# EAGLE board BaseBoard5 (EAGLE 6.5.0), part 1 of 2
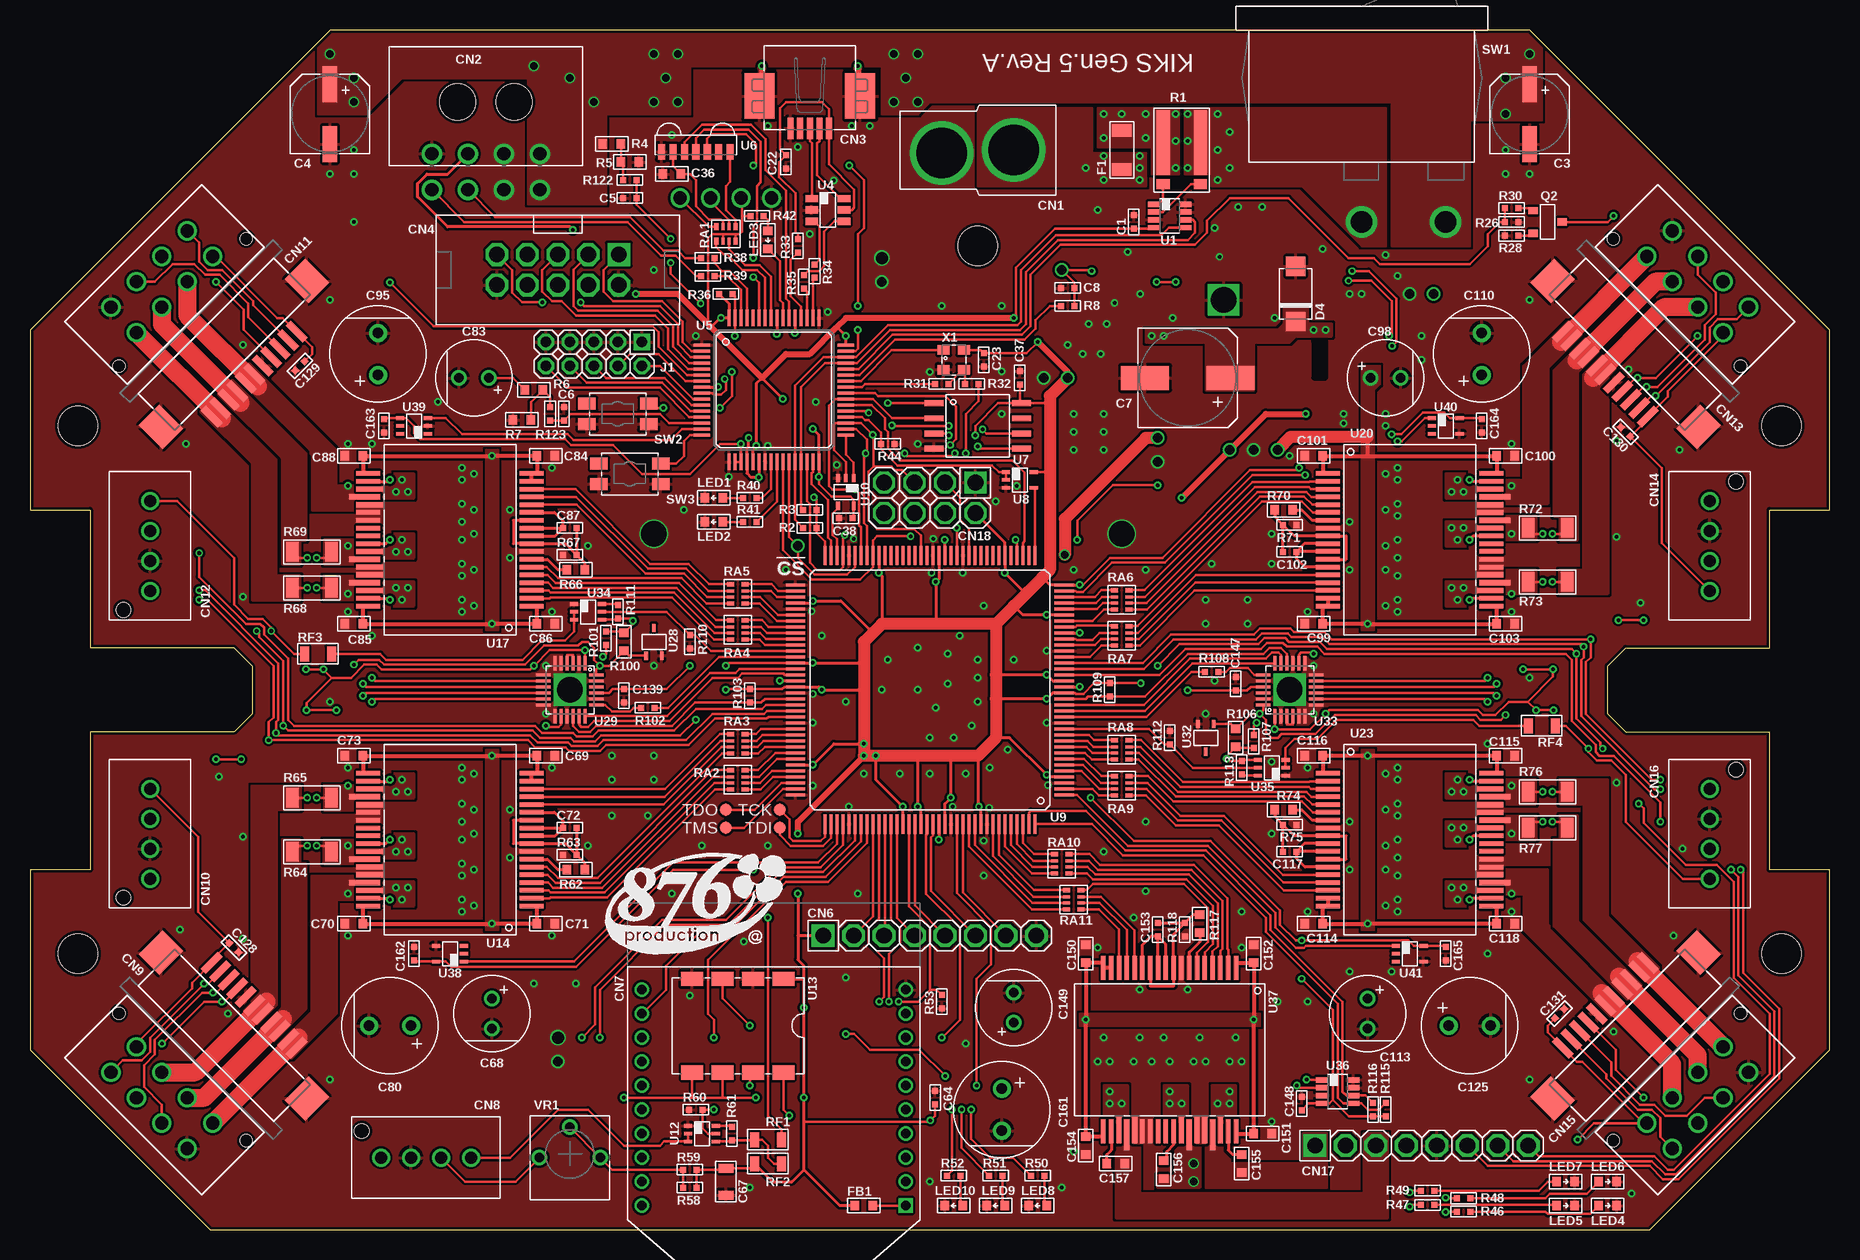
[diagram p5: board, top side]
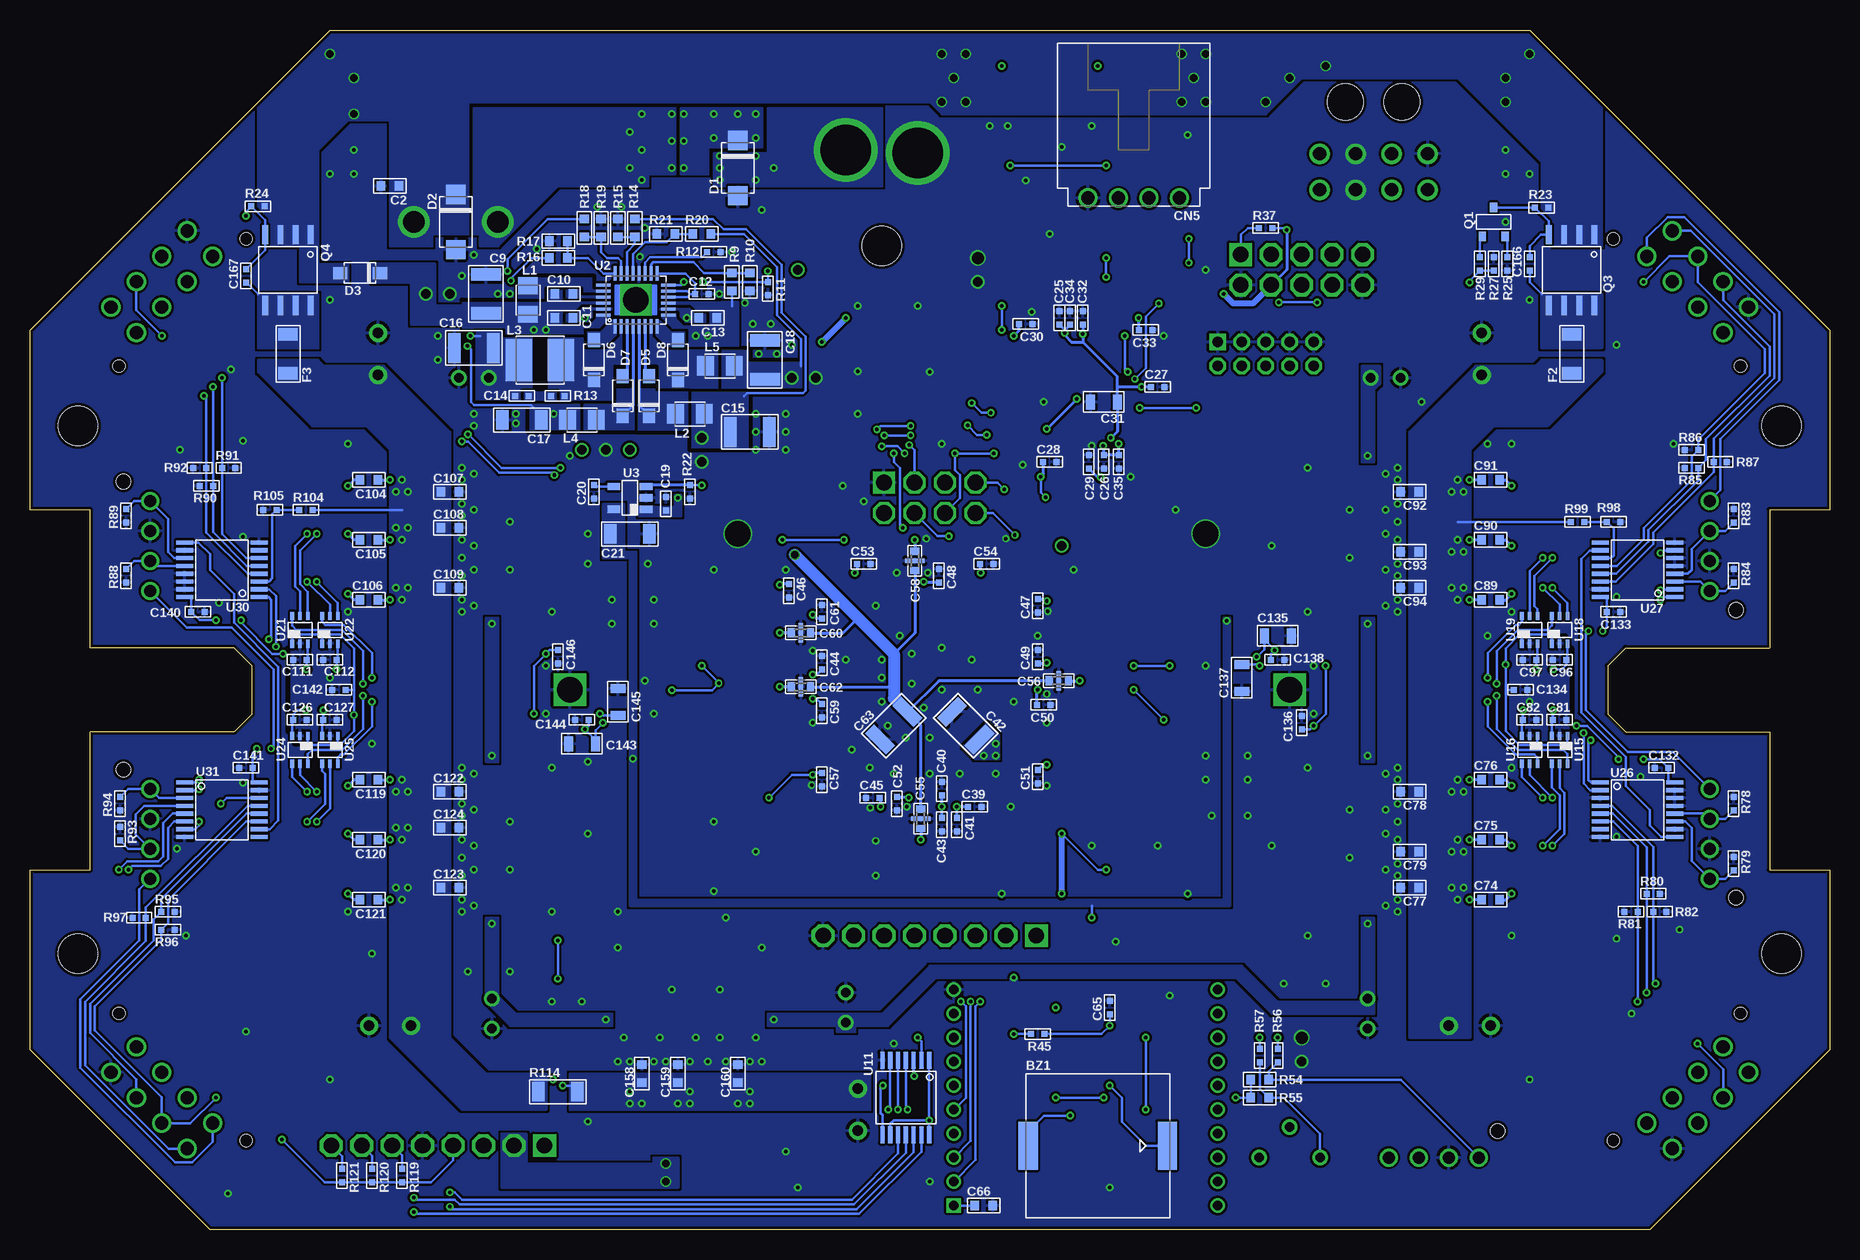
[diagram p6: board, bottom side, seen from below]

Size 150 x 100 mm. Coordinates in mm from the lower left corner, seen from the top.
Outline: 15,0 135,0 150,15 150,30 145,30 145,41.5 133,41.5 131.5,43 131.5,47 133,48.5 145,48.5 145,60 150,60 150,75 125,100 25,100 0,75 0,60 5,60 5,48.5 17,48.5 18.5,47 18.5,43 17,41.5 5,41.5 5,30 0,30 0,15 15,0
Copper layers (1*16): Top 0.035mm / dielectric 1.6mm / Bottom 0.035mm
Design rules "seeedstudio": minimum track width 6mil, minimum drill 0.3mm, track to track 6mil, track to pad 6mil, pad to pad 6mil, via to via 6mil, smd to smd 5mil, copper to edge 10mil, drill to drill 10mil, minimum pad ring 0.2mm, minimum via ring 6mil, stop-mask expansion 4mil, vias tented up to drill 3mm, thermal gap 10mil
Holes 3.3 mm at 4,67 4,23 146,23 146,67 79,82
tRestrict: 4 lines
bRestrict: 119 lines

## Footprints (pad centres in the part's own frame; a part is rotated, then mirrored left to right if it is on the bottom)
PKLCS1212 = smd 1.6 x 4: 1 -5.8,0; 2 5.8,0
1005 = smd 0.5 x 0.5: 1 -0.55,0; 2 0.55,0
1608 = smd 0.7 x 0.8: 1 -0.75,0; 2 0.75,0
ES-6.3 = smd 3 x 1.2: N 2.5,0; P -2.5,0
ES2-8 = smd 4 x 2: N 3.55,0; P -3.55,0
3225 = smd 1.05 x 2.5: 1 -1.625,0; 2 1.625,0
3216 = smd 1.05 x 1.6: 1 -1.625,0; 2 1.625,0
2012 = smd 0.75 x 1.25: 1 -1.125,0; 2 1.125,0
NFM18 = smd 0.6 x 0.8: 1 -0.8,0; 2 0.8,0 | smd 0.4 x 1.6: GND 0,0
E2.5-6.3 = drill 0.8 pad 1.3: N 1.25,0; P -1.25,0
E3.5-8 = drill 0.9 pad 1.5: N 1.75,0; P -1.75,0
T-CON = drill 4.2 pad 5.3: N -3,-0.25; P 3,0
43045-0800 = drill 1.1 pad 1.7: 1 -4.5,-4.32; 2 -1.5,-4.32; 3 1.5,-4.32; 4 4.5,-4.32; 5 -4.5,-7.32; 6 -1.5,-7.32; 7 1.5,-7.32; 8 4.5,-7.32 | hole 3: 2.35,0; -2.35,0
UX60SC-MB-5ST = smd 1.8 x 0.5: 1 2.7,1.6; 2 2.7,0.8; 3 2.7,0; 4 2.7,-0.8; 5 2.7,-1.6 | smd 3.8 x 2.5: S1 0,-4.2; S2 0,4.2
PIN2X5-BOX = drill 1.3 pad 1.9 square: 1 -5.08,-1.27 | drill 1.3 pad 1.9 octagon: 2 -5.08,1.27; 3 -2.54,-1.27; 4 -2.54,1.27; 5 0,-1.27; 6 0,1.27; 7 2.54,-1.27; 8 2.54,1.27; 9 5.08,-1.27; 10 5.08,1.27
70553-0003 = drill 1.1 pad 1.6: 1 3.81,0; 2 1.27,0; 3 -1.27,0; 4 -3.81,0
PIN1X8 = drill 1.3 pad 1.9 square: 1 -8.89,0 | drill 1.3 pad 1.9 octagon: 2 -6.35,0; 3 -3.81,0; 4 -1.27,0; 5 1.27,0; 6 3.81,0; 7 6.35,0; 8 8.89,0
XBEE-TH = drill 0.8 square: 1 -11,9 | drill 0.8: 2 -11,7; 3 -11,5; 4 -11,3; 5 -11,1; 6 -11,-1; 7 -11,-3; 8 -11,-5; 9 -11,-7; 10 -11,-9; 11 11,-9; 12 11,-7; 13 11,-5; 14 11,-3; 15 11,-1; 16 11,1; 17 11,3; 18 11,5; 19 11,7; 20 11,9
53375-04 = drill 1 pad 1.5: 1 3.75,0; 2 1.25,0; 3 -1.25,0; 4 -3.75,0 | hole 1.2: 5.35,-2.2
MOTOR_COMPLEX2 = smd 0.6 x 2: 1.1 5,-2.4; 1.2 4,-2.4; 1.3 3,-2.4; 1.4 2,-2.4; 1.5 1,-2.4; 1.6 0,-2.4; 1.7 -1,-2.4; 1.8 -2,-2.4; 1.9 -3,-2.4; 1.10 -4,-2.4; 1.11 -5,-2.4 | drill 1.1 pad 1.5: 2.1 -4.5,10; 2.2 -1.5,10; 2.3 1.5,10; 2.4 4.5,10; 2.5 -4.5,7; 2.6 -1.5,7; 2.7 1.5,7; 2.8 4.5,7 | smd 2.4 x 2.8: S1 -8.6,0; S2 8.6,0 | hole 1: -7.5,6.06; 7.5,6.06
PIN2X4 = drill 1.3 square: 1 -3.81,-1.27 | drill 1.3 octagon: 2 -3.81,1.27; 3 -1.27,-1.27; 4 -1.27,1.27; 5 1.27,-1.27; 6 1.27,1.27; 7 3.81,-1.27; 8 3.81,1.27
DO-214AC = smd 1.6 x 1.6: A 2.3,0; K -2.3,0
SOD123W = smd 1.2 x 1: A 1.65,0; K -1.65,0
PIN2X5-2.0 = drill 0.9 pad 1.3 square: 1 -4,-1 | drill 0.9 pad 1.3 octagon: 2 -4,1; 3 -2,-1; 4 -2,1; 5 0,-1; 6 0,1; 7 2,-1; 8 2,1; 9 4,-1; 10 4,1
L2520 = smd 1.4 x 1.65: 1 -1.2,0; 2 1.2,0
L4040 = smd 2.2 x 3.5: 1 -1.75,0; 2 1.75,0
1608' = smd 0.7 x 0.8: A 0.75,0; K -0.75,0
PAD = smd 1 x 1: 1 0,0
SOT23-3 = smd 0.6 x 0.8: 1 -0.95,-1.2; 2 0.95,-1.2; 3 0,1.2
SOP8 = smd 0.48 x 1.6: 1 -1.905,-2.95; 2 -0.635,-2.95; 3 0.635,-2.95; 4 1.905,-2.95; 5 1.905,2.95; 6 0.635,2.95; 7 -0.635,2.95; 8 -1.905,2.95
FC4L = smd 1.1 x 0.8: I1 -1.55,-2.85; I2 1.55,-2.85 | smd 1.1 x 5.4: V1 -1.55,0.6; V2 1.55,0.6
1005-A4 = smd 0.6 x 0.35: A1 -0.6,0.8; A2 0.6,0.8; D1 -0.6,-0.8; D2 0.6,-0.8 | smd 0.6 x 0.25: B1 -0.6,0.25; B2 0.6,0.25; C1 -0.6,-0.25; C2 0.6,-0.25
SLE6_10A4 = drill 1.8 pad 2.6: 1 0,7; P 0,0
EVQ-P2_P9 = smd 1.45 x 1: A1 -2.575,-0.85; A2 2.575,-0.85; B1 -2.575,0.85; B2 2.575,0.85
SOT23-8 = smd 0.45 x 1: 1 -0.975,-1.3; 2 -0.325,-1.3; 3 0.325,-1.3; 4 0.975,-1.3; 5 0.975,1.3; 6 0.325,1.3; 7 -0.325,1.3; 8 -0.975,1.3
QFN28-0.5-PAD = smd 1.2 x 0.25: 1 -2.2,1.75; 2 -2.2,1.25; 3 -2.2,0.75; 4 -2.2,0.25; 5 -2.2,-0.25; 6 -2.2,-0.75; 7 -2.2,-1.25; 8 -2.2,-1.75; 15 2.2,-1.75; 16 2.2,-1.25; 17 2.2,-0.75; 18 2.2,-0.25; 19 2.2,0.25; 20 2.2,0.75; 21 2.2,1.25; 22 2.2,1.75 | smd 0.25 x 1.2: 9 -1.25,-2.7; 10 -0.75,-2.7; 11 -0.25,-2.7; 12 0.25,-2.7; 13 0.75,-2.7; 14 1.25,-2.7; 23 1.25,2.7; 24 0.75,2.7; 25 0.25,2.7; 26 -0.25,2.7; 27 -0.75,2.7; 28 -1.25,2.7 | drill 2.1 pad 2.6 square: PAD 0,0
SOT23-5 = smd 0.6 x 1.05: 1 -0.95,-1.35; 2 0,-1.35; 3 0.95,-1.35; 4 0.95,1.35; 5 -0.95,1.35
SOT23-6 = smd 0.6 x 1.05: 1 -0.95,-1.35; 2 0,-1.35; 3 0.95,-1.35; 4 0.95,1.35; 5 0,1.35; 6 -0.95,1.35
QFP64-0.5 = smd 1.4 x 0.25: 1 -6,3.75; 2 -6,3.25; 3 -6,2.75; 4 -6,2.25; 5 -6,1.75; 6 -6,1.25; 7 -6,0.75; 8 -6,0.25; 9 -6,-0.25; 10 -6,-0.75; 11 -6,-1.25; 12 -6,-1.75; 13 -6,-2.25; 14 -6,-2.75; 15 -6,-3.25; 16 -6,-3.75; 33 6,-3.75; 34 6,-3.25; 35 6,-2.75; 36 6,-2.25; 37 6,-1.75; 38 6,-1.25; 39 6,-0.75; 40 6,-0.25; 41 6,0.25; 42 6,0.75; 43 6,1.25; 44 6,1.75; 45 6,2.25; 46 6,2.75; 47 6,3.25; 48 6,3.75 | smd 0.25 x 1.4: 17 -3.75,-6; 18 -3.25,-6; 19 -2.75,-6; 20 -2.25,-6; 21 -1.75,-6; 22 -1.25,-6; 23 -0.75,-6; 24 -0.25,-6; 25 0.25,-6; 26 0.75,-6; 27 1.25,-6; 28 1.75,-6; 29 2.25,-6; 30 2.75,-6; 31 3.25,-6; 32 3.75,-6; 49 3.75,6; 50 3.25,6; 51 2.75,6; 52 2.25,6; 53 1.75,6; 54 1.25,6; 55 0.75,6; 56 0.25,6; 57 -0.25,6; 58 -0.75,6; 59 -1.25,6; 60 -1.75,6; 61 -2.25,6; 62 -2.75,6; 63 -3.25,6; 64 -3.75,6
TFBS4650 = smd 0.6 x 1.3: 1 -2.85,0.65; 2 -1.9,0.65; 3 -0.95,0.65; 4 0,0.65; 5 0.95,0.65; 6 1.9,0.65; 7 2.85,0.65
SOP8W = smd 0.48 x 1.6: 1 -1.905,-3.65; 2 -0.635,-3.65; 3 0.635,-3.65; 4 1.905,-3.65; 5 1.905,3.65; 6 0.635,3.65; 7 -0.635,3.65; 8 -1.905,3.65
SC70-5 = smd 0.3 x 0.7: 1 -0.65,-1.15; 2 0,-1.15; 3 0.65,-1.15; 4 0.65,1.15; 5 -0.65,1.15
QFP144-0.5 = smd 1.6 x 0.25: 1 -11.2,8.75; 2 -11.2,8.25; 3 -11.2,7.75; 4 -11.2,7.25; 5 -11.2,6.75; 6 -11.2,6.25; 7 -11.2,5.75; 8 -11.2,5.25; 9 -11.2,4.75; 10 -11.2,4.25; 11 -11.2,3.75; 12 -11.2,3.25; 13 -11.2,2.75; 14 -11.2,2.25; 15 -11.2,1.75; 16 -11.2,1.25; 17 -11.2,0.75; 18 -11.2,0.25; 19 -11.2,-0.25; 20 -11.2,-0.75; 21 -11.2,-1.25; 22 -11.2,-1.75; 23 -11.2,-2.25; 24 -11.2,-2.75; 25 -11.2,-3.25; 26 -11.2,-3.75; 27 -11.2,-4.25; 28 -11.2,-4.75; 29 -11.2,-5.25; 30 -11.2,-5.75; 31 -11.2,-6.25; 32 -11.2,-6.75; 33 -11.2,-7.25; 34 -11.2,-7.75; 35 -11.2,-8.25; 36 -11.2,-8.75; 73 11.2,-8.75; 74 11.2,-8.25; 75 11.2,-7.75; 76 11.2,-7.25; 77 11.2,-6.75; 78 11.2,-6.25; 79 11.2,-5.75; 80 11.2,-5.25; 81 11.2,-4.75; 82 11.2,-4.25; 83 11.2,-3.75; 84 11.2,-3.25; 85 11.2,-2.75; 86 11.2,-2.25; 87 11.2,-1.75; 88 11.2,-1.25; 89 11.2,-0.75; 90 11.2,-0.25; 91 11.2,0.25; 92 11.2,0.75; 93 11.2,1.25; 94 11.2,1.75; 95 11.2,2.25; 96 11.2,2.75; 97 11.2,3.25; 98 11.2,3.75; 99 11.2,4.25; 100 11.2,4.75; 101 11.2,5.25; 102 11.2,5.75; 103 11.2,6.25; 104 11.2,6.75; 105 11.2,7.25; 106 11.2,7.75; 107 11.2,8.25; 108 11.2,8.75 | smd 0.25 x 1.6: 37 -8.75,-11.2; 38 -8.25,-11.2; 39 -7.75,-11.2; 40 -7.25,-11.2; 41 -6.75,-11.2; 42 -6.25,-11.2; 43 -5.75,-11.2; 44 -5.25,-11.2; 45 -4.75,-11.2; 46 -4.25,-11.2; 47 -3.75,-11.2; 48 -3.25,-11.2; 49 -2.75,-11.2; 50 -2.25,-11.2; 51 -1.75,-11.2; 52 -1.25,-11.2; 53 -0.75,-11.2; 54 -0.25,-11.2; 55 0.25,-11.2; 56 0.75,-11.2; 57 1.25,-11.2; 58 1.75,-11.2; 59 2.25,-11.2; 60 2.75,-11.2; 61 3.25,-11.2; 62 3.75,-11.2; 63 4.25,-11.2; 64 4.75,-11.2; 65 5.25,-11.2; 66 5.75,-11.2; 67 6.25,-11.2; 68 6.75,-11.2; 69 7.25,-11.2; 70 7.75,-11.2; 71 8.25,-11.2; 72 8.75,-11.2; 109 8.75,11.2; 110 8.25,11.2; 111 7.75,11.2; 112 7.25,11.2; 113 6.75,11.2; 114 6.25,11.2; 115 5.75,11.2; 116 5.25,11.2; 117 4.75,11.2; 118 4.25,11.2; 119 3.75,11.2; 120 3.25,11.2; 121 2.75,11.2; 122 2.25,11.2; 123 1.75,11.2; 124 1.25,11.2; 125 0.75,11.2; 126 0.25,11.2; 127 -0.25,11.2; 128 -0.75,11.2; 129 -1.25,11.2; 130 -1.75,11.2; 131 -2.25,11.2; 132 -2.75,11.2; 133 -3.25,11.2; 134 -3.75,11.2; 135 -4.25,11.2; 136 -4.75,11.2; 137 -5.25,11.2; 138 -5.75,11.2; 139 -6.25,11.2; 140 -6.75,11.2; 141 -7.25,11.2; 142 -7.75,11.2; 143 -8.25,11.2; 144 -8.75,11.2
TSSOP14 = smd 0.35 x 1.4: 1 -1.95,-3.1; 2 -1.3,-3.1; 3 -0.65,-3.1; 4 0,-3.1; 5 0.65,-3.1; 6 1.3,-3.1; 7 1.95,-3.1; 8 1.95,3.1; 9 1.3,3.1; 10 0.65,3.1; 11 0,3.1; 12 -0.65,3.1; 13 -1.3,3.1; 14 -1.95,3.1
SC70-6 = smd 0.3 x 0.7: 1 -0.65,-1.15; 2 0,-1.15; 3 0.65,-1.15; 4 0.65,1.15; 5 0,1.15; 6 -0.65,1.15
AE-NJU72501 = smd 1.2 x 1.8: 1 -3.9,3.81; 2 -3.9,1.27; 3 -3.9,-1.27; 4 -3.9,-3.81; 5 3.9,-3.81; 6 3.9,-1.27; 7 3.9,1.27; 8 3.9,3.81
HSSOP36 = smd 0.381 x 2: 1 -5.525,-6.8; 2 -4.875,-6.8; 3 -4.225,-6.8; 4 -3.575,-6.8; 5 -2.925,-6.8; 6 -2.275,-6.8; 7 -1.625,-6.8; 8 -0.975,-6.8; 9 -0.325,-6.8; 10 0.325,-6.8; 11 0.975,-6.8; 12 1.625,-6.8; 13 2.275,-6.8; 14 2.925,-6.8; 15 3.575,-6.8; 16 4.225,-6.8; 17 4.875,-6.8; 18 5.525,-6.8; 19 5.525,6.8; 20 4.875,6.8; 24 2.275,6.8; 25 1.625,6.8; 26 0.975,6.8; 27 0.325,6.8; 28 -0.325,6.8; 35 -4.875,6.8; 36 -5.525,6.8 | smd 0.44 x 2.3: 21 4.225,6.65; 23 2.925,6.65; 29 -0.975,6.65; 31 -2.275,6.65; 32 -2.925,6.65; 34 -4.225,6.65 | smd 0.44 x 2.6: 22 3.575,7.1; 30 -1.625,7.1; 33 -3.575,7.1
TSSOP16 = smd 0.35 x 1.4: 1 -2.275,-3.1; 2 -1.625,-3.1; 3 -0.975,-3.1; 4 -0.325,-3.1; 5 0.325,-3.1; 6 0.975,-3.1; 7 1.625,-3.1; 8 2.275,-3.1; 9 2.275,3.1; 10 1.625,3.1; 11 0.975,3.1; 12 0.325,3.1; 13 -0.325,3.1; 14 -0.975,3.1; 15 -1.625,3.1; 16 -2.275,3.1
SC70-3 = smd 0.3 x 0.7: 1 -0.65,-1.15; 2 0.65,-1.15; 3 0,1.15
QFN24-0.5 = smd 1.2 x 0.25: 1 -2.2,1.25; 2 -2.2,0.75; 3 -2.2,0.25; 4 -2.2,-0.25; 5 -2.2,-0.75; 6 -2.2,-1.25; 13 2.2,-1.25; 14 2.2,-0.75; 15 2.2,-0.25; 16 2.2,0.25; 17 2.2,0.75; 18 2.2,1.25 | smd 0.25 x 1.2: 7 -1.25,-2.2; 8 -0.75,-2.2; 9 -0.25,-2.2; 10 0.25,-2.2; 11 0.75,-2.2; 12 1.25,-2.2; 19 1.25,2.2; 20 0.75,2.2; 21 0.25,2.2; 22 -0.25,2.2; 23 -0.75,2.2; 24 -1.25,2.2 | drill 2.1 pad 2.7 square: P 0,0
VR = drill 0.8 pad 1.3: A -2.54,0; B 2.54,0; W 0,2.54
OSC2520 = smd 0.8 x 1: 1 -0.825,-0.85; 2 0.825,-0.85; 3 0.825,0.85; 4 -0.825,0.85

## Placement (x,y rotation side)
BZ1  PKLCS1212E4001  [PKLCS1212]  61,7 0 bottom
C1  100n  [1005]  92,84 90 top
C2  100n  [1608]  120,87 180 bottom
C3  100u  [ES-6.3]  125,93 270 top
C4  100u  [ES-6.3]  25,93 270 top
C5  10n  [1005]  50,86 180 top
C6  10n  [1005]  44.5,68 90 top
C7  330u  [ES2-8]  96.5,71 180 top
C8  1u  [1005]  86.5,78.5 180 top
C9  22u  [3225]  112,78 90 bottom
C10  1u  [1608]  105.5,78 180 bottom
C11  1u  [1608]  105.5,76 0 bottom
C12  10n  [1005]  94,78 0 bottom
C13  1u  [1608]  93.5,76 180 bottom
C14  1n  [1005]  109,69.5 180 bottom
C15  100u  [3225]  90,66.5 0 bottom
C16  22u  [3225]  113,73.5 180 bottom
C17  22u  [3216]  109,67.5 180 bottom
C18  100u  [3225]  88.75,72.5 90 bottom
C19  1u  [1005]  97,60.5 90 bottom
C20  10n  [1005]  103,61.5 270 bottom
C21  22u  [3216]  100,58 0 bottom
C22  100n  [1005]  63,89 270 top
C23  10n  [1005]  79.5,72.5 270 top
C25  1n  [1005]  64.2,76 90 bottom
C26  100n  [1005]  60.5,64 270 bottom
C27  100n  [1005]  56,70.25 0 bottom
C28  100n  [1005]  65,64 0 bottom
C29  100n  [1005]  61.75,64 90 bottom
C30  100n  [1005]  67,75.5 0 bottom
C31  22u  [2012]  60.5,69 180 bottom
C32  100n  [1005]  62.25,76 90 bottom
C33  100n  [1005]  57,75 0 bottom
C34  100n  [1005]  63.3,76 90 bottom
C35  100n  [1005]  59.25,64 270 bottom
C36  10u  [1608]  53.5,88 180 top
C37  100n  [1005]  82.5,71 90 top
C38  100n  [1005]  68,59.3 180 top
C39  1n  [1005]  71.25,35.25 0 bottom
C40  1n  [1005]  74,36.75 90 bottom
C41  100n  [1005]  72.75,33.75 270 bottom
C42  100u  [3225]  72,42 135 bottom
C43  100n  [1005]  74,33.75 270 bottom
C44  100n  [1005]  84,47.25 90 bottom
C45  100n  [1005]  79.75,36 180 bottom
C46  100n  [1005]  86.75,53.25 270 bottom
C47  100n  [1005]  66,52 270 bottom
C48  100n  [1005]  74.25,54.5 90 bottom
C49  100n  [1005]  66,47.75 90 bottom
C50  100n  [1005]  65.5,43.75 0 bottom
C51  100n  [1005]  66,37.75 270 bottom
C52  100n  [1005]  77.75,35.5 270 bottom
C53  100n  [1005]  80.5,55.5 0 bottom
C54  100n  [1005]  70.25,55.5 0 bottom
C55  100n  [NFM18]  75.75,34.25 90 bottom
C56  100n  [NFM18]  64.25,45.75 180 bottom
C57  100n  [1005]  84,37.5 270 bottom
C58  100n  [NFM18]  76.25,55.75 270 bottom
C59  100n  [1005]  84,43.25 270 bottom
C60  100n  [NFM18]  85.75,49.75 0 bottom
C61  100n  [1005]  84,51.5 90 bottom
C62  100n  [NFM18]  85.75,45.25 0 bottom
C63  100u  [3225]  78,42 225 bottom
C64  1u  [1005]  75.45,11 90 top
C65  1n  [1005]  60,18.5 90 bottom
C66  1u  [1608]  70.5,2 0 bottom
C67  22u  [2012]  58,4 270 top
C68  100u  [E2.5-6.3]  38.5,18 270 top
C69  1u  [1608]  43,39.5 0 top
C70  1u  [1608]  27,25.5 180 top
C71  1u  [1608]  43,25.5 0 top
C72  100n  [1005]  45,33.5 0 top
C73  1u  [1608]  27,39.5 180 top
C74  100n  [1608]  28.25,27.5 0 bottom
C75  100n  [1608]  28.25,32.5 0 bottom
C76  100n  [1608]  28.25,37.5 0 bottom
C77  100n  [1608]  35,28.5 180 bottom
C78  100n  [1608]  35,36.5 180 bottom
C79  100n  [1608]  35,31.5 180 bottom
C80  220u  [E3.5-8]  30,17 180 top
C81  100n  [1005]  22.5,42.5 0 bottom
C82  100n  [1005]  25,42.5 0 bottom
C83  100u  [E2.5-6.3]  37,71 180 top
C84  1u  [1608]  43,64.5 0 top
C85  1u  [1608]  27,50.5 180 top
C86  1u  [1608]  43,50.5 0 top
C87  100n  [1005]  45,58.5 0 top
C88  1u  [1608]  27,64.5 180 top
C89  100n  [1608]  28.25,52.5 0 bottom
C90  100n  [1608]  28.25,57.5 0 bottom
C91  100n  [1608]  28.25,62.5 0 bottom
C92  100n  [1608]  35,61.5 180 bottom
C93  100n  [1608]  35,56.5 180 bottom
C94  100n  [1608]  35,53.5 180 bottom
C95  220u  [E3.5-8]  29,73 90 top
C96  100n  [1005]  22.5,47.5 180 bottom
C97  100n  [1005]  25,47.5 180 bottom
C98  100u  [E2.5-6.3]  113,71 0 top
C99  1u  [1608]  107,50.5 180 top
C100  1u  [1608]  123,64.5 0 top
C101  1u  [1608]  107,64.5 180 top
C102  100n  [1005]  105,56.5 180 top
C103  1u  [1608]  123,50.5 0 top
C104  100n  [1608]  121.75,62.5 180 bottom
C105  100n  [1608]  121.75,57.5 180 bottom
C106  100n  [1608]  121.75,52.5 180 bottom
C107  100n  [1608]  115,61.5 0 bottom
C108  100n  [1608]  115,58.5 0 bottom
C109  100n  [1608]  115,53.5 0 bottom
C110  220u  [E3.5-8]  121,73 90 top
C111  100n  [1005]  127.5,47.5 180 bottom
C112  100n  [1005]  125,47.5 180 bottom
C113  100u  [E2.5-6.3]  111.5,18 270 top
C114  1u  [1608]  107,25.5 180 top
C115  1u  [1608]  123,39.5 0 top
C116  1u  [1608]  107,39.5 180 top
C117  100n  [1005]  105,31.5 180 top
C118  1u  [1608]  123,25.5 0 top
C119  100n  [1608]  121.75,37.5 180 bottom
C120  100n  [1608]  121.75,32.5 180 bottom
C121  100n  [1608]  121.75,27.5 180 bottom
C122  100n  [1608]  115,36.5 0 bottom
C123  100n  [1608]  115,28.5 0 bottom
C124  100n  [1608]  115,33.5 0 bottom
C125  220u  [E3.5-8]  120,17 0 top
C126  100n  [1005]  127.5,42.5 0 bottom
C127  100n  [1005]  125,42.5 0 bottom
C128  1u  [1005]  17,23.5 315 top
C129  1u  [1005]  22.5,72 225 top
C130  1u  [1005]  133,66.5 135 top
C131  1u  [1005]  127.5,18 45 top
C132  100n  [1005]  14,38.5 180 bottom
C133  100n  [1005]  18,51.5 0 bottom
C134  1u  [1005]  25.75,45 0 bottom
C135  22u  [2012]  46,49.5 0 bottom
C136  100n  [1005]  44,42.25 90 bottom
C137  22u  [2012]  49,46 270 bottom
C138  100n  [1005]  46,47.5 0 bottom
C139  100n  [1005]  49.5,44.5 270 top
C140  100n  [1005]  136,51.5 0 bottom
C141  100n  [1005]  132,38.5 180 bottom
C142  1u  [1005]  124.25,45 180 bottom
C143  22u  [2012]  104,40.5 180 bottom
C144  100n  [1005]  104,42.5 180 bottom
C145  22u  [2012]  101,44 90 bottom
C146  100n  [1005]  106,47.75 270 bottom
C147  100n  [1005]  100.5,45.5 90 top
C148  100n  [1005]  106,10.5 90 top
C149  100u  [E2.5-6.3]  82,18.5 90 top
C150  1u  [1608]  88,23 90 top
C151  1u  [1608]  102.75,8 0 top
C152  1u  [1608]  102,23 90 top
C153  100n  [1005]  94,25 90 top
C154  1u  [1608]  88,7 270 top
C155  100n  [1608]  101,5.5 270 top
C156  100n  [1608]  94.5,5 270 top
C157  100n  [1608]  90.5,5.5 0 top
C158  100n  [1608]  99,13 90 bottom
C159  100n  [1608]  96,13 90 bottom
C160  100n  [1608]  91,13 90 bottom
C161  220u  [E3.5-8]  81,10 270 top
C162  100n  [1005]  32,23 90 top
C163  100n  [1005]  29.5,67 270 top
C164  100n  [1005]  121,67 270 top
C165  100n  [1005]  118,23 270 top
C166  10n  [1005]  25,80.5 90 bottom
C167  10n  [1005]  132,79.5 90 bottom
CN1  Battery  [T-CON]  79,90 0 top
CN2  Kicker  [43045-0800]  38,94 0 top
CN3  UX60SC-MB-5ST  [UX60SC-MB-5ST]  65,94.5 270 top
CN4  CN-JTAG_ALTERA-BOX  [PIN2X5-BOX]  44,80.01 180 top
CN5  Debug  [70553-0003]  58,86 0 bottom
CN6  External SPI 1  [PIN1X8]  75,24.5 0 top
CN7  XBee  [XBEE-TH]  62,11 180 top
CN8  Ball Sensor  [53375-04]  33,6 180 top
CN9  EC45FLAT2  [MOTOR_COMPLEX2]  17,17 135 top
CN10  Motor1  [53375-04]  10,33 270 top
CN11  EC45FLAT2  [MOTOR_COMPLEX2]  17,73 45 top
CN12  Motor2  [53375-04]  10,57 270 top
CN13  EC45FLAT2  [MOTOR_COMPLEX2]  133,73 315 top
CN14  Motor3  [53375-04]  140,57 90 top
CN15  EC45FLAT2  [MOTOR_COMPLEX2]  133,17 225 top
CN16  Motor4  [53375-04]  140,33 90 top
CN17  Dribble  [PIN1X8]  116,7 0 top
CN18  External SPI 2  [PIN2X4]  75,61 180 top
D1  SMAJ22A  [DO-214AC]  91,88.5 270 bottom
D2  SMAJ22A  [DO-214AC]  114.5,84 270 bottom
D3  PMEG4030ER  [SOD123W]  122.5,79.75 180 bottom
D4  SMAJ24A  [DO-214AC]  105.5,78 90 top
D5  PMEG4030ER  [SOD123W]  98.4,69.5 90 bottom
D6  PMEG4030ER  [SOD123W]  103,72.5 90 bottom
D7  PMEG4030ER  [SOD123W]  100.6,69.5 90 bottom
D8  PMEG4030ER  [SOD123W]  96,72.5 90 bottom
F1  15  [3216]  91,90 90 top
F2  10  [3216]  21.5,73 270 bottom
F3  10  [3216]  128.5,73 270 bottom
FB1  [1608]  69.5,2 0 top
J1  Setting  [PIN2X5-2.0]  47,73 180 top
L1  4.7u  [L2520]  108.5,77.5 90 bottom
L2  3.3u  [L2520]  95,68 0 bottom
L3  10u  [L4040]  107.5,72.5 180 bottom
L4  4.7u  [L2520]  104,67.5 180 bottom
L5  4.7u  [L2520]  92.5,72 0 bottom
LED1  [1608']  57,61 0 top
LED2  [1608']  57,59 0 top
LED3  [1608']  61.5,82.5 90 top
LED4  [1608']  131.5,2 180 top
LED5  [1608']  128,2 180 top
LED6  [1608']  131.5,4 180 top
LED7  [1608']  128,4 180 top
LED8  [1608']  84,2 0 top
LED9  [1608']  80.5,2 0 top
LED10  [1608']  77,2 0 top
LOGO1  LOGO-876_SMALL  [LOGO-876_SMALL]  48,23 0 top
P1  TCK  [PAD]  62.5,35 180 top
P2  TDI  [PAD]  62.5,33.5 180 top
P3  TDO  [PAD]  58,35 180 top
P4  TMS  [PAD]  58,33.5 180 top
Q1  [SOT23-3]  28,84 0 bottom
Q2  [SOT23-3]  126.5,84 270 top
Q3  Si4483ADY  [SOP8]  21.5,80 180 bottom
Q4  Si4483ADY  [SOP8]  128.5,80 180 bottom
R1  2m  [FC4L]  96,90 0 top
R2  10k  [1005]  65,58.5 0 top
R3  10k  [1005]  65,60 0 top
R4  100k  [1608]  48.5,90.5 180 top
R5  10k  [1608]  50,89 180 top
R6  100k  [1608]  42,70 180 top
R7  10k  [1608]  41,67.5 0 top
R8  10k  [1005]  86.5,77 0 top
R9  100k  [1608]  91.5,79 270 bottom
R10  24k  [1608]  90,79 90 bottom
R11  10k  [1005]  88.5,78.45 90 bottom
R12  10k  [1005]  93,81.5 180 bottom
R13  1k  [1005]  106,69.5 0 bottom
R14  3.9k  [1608]  99.6,83.5 90 bottom
R15  7.5k  [1608]  101,83.5 270 bottom
R16  24k  [1608]  105.95,81 180 bottom
R17  1.65k  [1608]  105.95,82.4 0 bottom
R18  24k  [1608]  103.8,83.5 90 bottom
R19  3.9k  [1608]  102.4,83.5 270 bottom
R20  24k  [1608]  94,83 0 bottom
R21  7.5k  [1608]  97,83 0 bottom
R22  10k  [1005]  95,61.5 90 bottom
R23  33k  [1005]  24,85.2 0 bottom
R24  33k  [1005]  131,85.3 0 bottom
R25  1k  [1005]  26.85,80.5 90 bottom
R26  1k  [1005]  123.5,82.85 0 top
R27  10k  [1005]  28,80.5 270 bottom
R28  10k  [1005]  123.5,84 180 top
R29  51  [1005]  29.15,80.5 270 bottom
R30  51  [1005]  123.5,85.15 180 top
R31  51  [1005]  76,70.5 180 top
R32  51  [1005]  78.5,70.5 0 top
R33  51  [1005]  64,82 90 top
R34  22  [1005]  65.4,79.9 270 top
R35  22  [1005]  64.5,79 270 top
R36  10k  [1005]  58,78 180 top
R37  10k  [1005]  47,83.5 0 bottom
R38  51  [1005]  56.5,81 180 top
R39  51  [1005]  56.5,79.5 180 top
R40  1k  [1005]  60,61 0 top
R41  1k  [1005]  60,59 0 top
R42  1k  [1005]  60.6,84.5 180 top
R44  10k  [1005]  71.5,65.5 180 top
R45  10k  [1005]  66,16.3 180 bottom
R46  1k  [1005]  119.5,1.5 180 top
R47  1k  [1005]  116.5,2.05 180 top
R48  1k  [1005]  119.5,2.6 180 top
R49  1k  [1005]  116.5,3.25 180 top
R50  1k  [1005]  84,4.5 180 top
R51  1k  [1005]  80.5,4.5 180 top
R52  1k  [1005]  77,4.5 180 top
R53  10k  [1005]  76,19 90 top
R54  3.9k  [1608]  47.5,12.5 180 bottom
R55  3.9k  [1608]  47.5,11 180 bottom
R56  1k  [1005]  46,14.5 90 bottom
R57  51  [1005]  47.5,14.5 90 bottom
R58  51  [1005]  55,3.5 0 top
R59  51  [1005]  55,5 0 top
R60  10k  [1005]  55.5,10 0 top
R61  10k  [1005]  58.5,8 270 top
R62  33k  [1608]  45.5,30 180 top
R63  1  [1005]  45,31.25 0 top
R64  5m  [3216]  23.5,31.5 180 top
R65  5m  [3216]  23.5,36 180 top
R66  33k  [1608]  45.5,55 180 top
R67  1  [1005]  45,56.25 0 top
R68  5m  [3216]  23.5,53.5 180 top
R69  5m  [3216]  23.5,56.5 180 top
R70  33k  [1608]  104.5,60 0 top
R71  1  [1005]  105,58.75 180 top
R72  5m  [3216]  126.5,58.5 0 top
R73  5m  [3216]  126.5,54 0 top
R74  33k  [1608]  104.5,35 0 top
R75  1  [1005]  105,33.75 180 top
R76  5m  [3216]  126.5,36.5 0 top
R77  5m  [3216]  126.5,33.5 0 top
R78  100k  [1005]  8,35.5 270 bottom
R79  100k  [1005]  8,30.5 270 bottom
R80  100k  [1005]  14.7,28 180 bottom
R81  100k  [1005]  16.55,26.5 0 bottom
R82  100k  [1005]  14.15,26.5 180 bottom
R83  100k  [1005]  8,59.5 270 bottom
R84  100k  [1005]  8,54.5 270 bottom
R85  100k  [1005]  11.5,63.5 0 bottom
R86  100k  [1005]  11.5,65 0 bottom
R87  100k  [1005]  9.1,64 180 bottom
R88  100k  [1005]  142,54.5 90 bottom
R89  100k  [1005]  142,59.5 90 bottom
R90  100k  [1005]  135.3,62 0 bottom
R91  100k  [1005]  133.45,63.5 180 bottom
R92  100k  [1005]  135.85,63.5 0 bottom
R93  100k  [1005]  142.5,33 270 bottom
R94  100k  [1005]  142.5,35.5 90 bottom
R95  100k  [1005]  138.5,26.5 180 bottom
R96  100k  [1005]  138.5,25 180 bottom
R97  100k  [1005]  140.9,26 0 bottom
R98  33k  [1005]  18,59 180 bottom
R99  100k  [1005]  21,59 180 bottom
R100  3.9k  [1608]  49.5,49 90 top
R101  51  [1005]  48,49.3 270 top
R102  51  [1005]  51.5,43.5 0 top
R103  10k  [1005]  60,44.5 90 top
R104  100k  [1005]  127,60 180 bottom
R105  33k  [1005]  130,60 0 bottom
R106  3.9k  [1608]  100.5,41 270 top
R107  51  [1005]  102,40.7 90 top
R108  51  [1005]  98.5,46.5 180 top
R109  10k  [1005]  90,45 90 top
R110  10k  [1005]  55,49 90 top
R111  10k  [1005]  49,51.5 270 top
R112  10k  [1005]  95,41 270 top
R113  10k  [1005]  101,38.5 90 top
R114  5m  [3216]  106,11.5 0 bottom
R115  10k  [1005]  113,10 270 top
R116  10k  [1005]  111.95,10 270 top
R117  33k  [1608]  97.5,25.5 270 top
R118  1  [1005]  96.25,25 90 top
R119  10k  [1005]  119,4.5 270 bottom
R120  10k  [1005]  121.5,4.5 270 bottom
R121  10k  [1005]  124,4.5 270 bottom
R122  1k  [1005]  50,87.5 0 top
R123  1k  [1005]  43.35,68 270 top
RA1  51  [1005-A4]  58,83 90 top
RA2  51  [1005-A4]  59,37.5 180 top
RA3  51  [1005-A4]  59,40.5 180 top
RA4  51  [1005-A4]  59,50 180 top
RA5  51  [1005-A4]  59,53 180 top
RA6  51  [1005-A4]  91,52.5 0 top
RA7  51  [1005-A4]  91,49.5 0 top
RA8  51  [1005-A4]  91,40 0 top
RA9  51  [1005-A4]  91,37 0 top
RA10  51  [1005-A4]  86,30.5 0 top
RA11  51  [1005-A4]  87,27.5 0 top
RF1  200m  [2012]  61.5,7.5 0 top
RF2  200m  [2012]  61.5,5.5 180 top
RF3  200m  [2012]  24,48 0 top
RF4  200m  [2012]  126,42 180 top
SW1  Power  [SLE6_10A4]  111,84 270 top
SW2  [EVQ-P2_P9]  49,68 0 top
SW3  [EVQ-P2_P9]  50,63 0 top
U1  INA219DCN  [SOT23-8]  95,84.5 270 top
U2  LT3504  [QFN28-0.5-PAD]  99.5,77.5 90 bottom
U3  SPX3819-50  [SOT23-5]  100,61 90 bottom
U4  IP4234CZ6  [SOT23-6]  66.5,85 270 top
U5  AT32UC3B0512-AU  [QFP64-0.5]  62,70 0 top
U6  TFBS4650  [TFBS4650]  55.5,90.5 180 top
U7  MX25L6445EM  [SOP8W]  79,67 270 top
U8  1G08DCK  [SC70-5]  82.5,62.5 270 top
U9  XC6SLX9-TQ144  [QFP144-0.5]  75,45 180 top
U10  1G08DCK  [SC70-5]  68,61.5 180 top
U11  TC74VHC164FT  [TSSOP14]  77,11 180 bottom
U12  FDG6323L  [SC70-6]  56,8 270 top
U13  AE-NJU72501  [AE-NJU72501]  59,17 270 top
U14  DRV8332  [HSSOP36]  35,32.5 90 top
U15  INA214  [SC70-6]  22.5,40 180 bottom
U16  INA214  [SC70-6]  25,40 180 bottom
U17  DRV8332  [HSSOP36]  35,57.5 90 top
U18  INA214  [SC70-6]  22.5,50 0 bottom
U19  INA214  [SC70-6]  25,50 0 bottom
U20  DRV8332  [HSSOP36]  115,57.5 270 top
U21  INA214  [SC70-6]  127.5,50 0 bottom
U22  INA214  [SC70-6]  125,50 0 bottom
U23  DRV8332  [HSSOP36]  115,32.5 270 top
U24  INA214  [SC70-6]  127.5,40 180 bottom
U25  INA214  [SC70-6]  125,40 180 bottom
U26  TC74VHC165FT  [TSSOP16]  16,35 270 bottom
U27  TC74VHC165FT  [TSSOP16]  16,55 90 bottom
U28  ADR5041  [SC70-3]  52,49 0 top
U29  ADS7950RGE  [QFN24-0.5]  45,45 270 top
U30  TC74VHC165FT  [TSSOP16]  134,55 90 bottom
U31  TC74VHC165FT  [TSSOP16]  134,35 270 bottom
U32  ADR5041  [SC70-3]  98,41 180 top
U33  ADS7950RGE  [QFN24-0.5]  105,45 90 top
U34  FDG6323L  [SC70-6]  46.5,51.5 270 top
U35  FDG6323L  [SC70-6]  103.5,38.5 90 top
U36  INA219DCN  [SOT23-8]  109,11.5 270 top
U37  DRV8332  [HSSOP36]  95,15 180 top
U38  TMP05  [SC70-5]  35,23 90 top
U39  MCP9701/LT  [SC70-6]  32,67 90 top
U40  TMP05  [SC70-5]  118,67 270 top
U41  TMP05  [SC70-5]  115,23 270 top
VR1  500  [VR]  45,6 0 top
X1  24MHz  [OSC2520]  77,72.5 270 top

## Tracks (layer width: path | path; a pad name or v marks a point on that pad's centre or on a via)
!ADC1_CS
  Top 0.2: U29.16 45.25,42 45.75,41.5 46.7,41.5 47.2,42 53.5,42 55.45,43.95 R103.1 60.95,43.95 61.25,44.25 U9.92
!ADC2_CS
  Top 0.2: U33.16 104.75,48 104.25,48.5 103.3,48.5 102.8,48 96.5,48 92.95,44.45 R109.1 88.2,44.45 88,44.25 U9.17
!FLASH_CS  (via drill 0.3)
  Top 0.2: U5.37 69.75,68.25 v69.9,68.1 | U7.1 v71.5,68.91 v71.5,68.9
  Bottom 0.2: v69.9,68.1 70.7,68.1 v71.5,68.9
!FPGA_CS  (via drill 0.8)
  Top 0.2: U9.67 68.75,55.25 68.1,54.6 65.4,54.6 64,56 v64,57 63.25,57.75 U5.27
!FPGA_INIT
  Top 0.2: U5.38 70.15,68.75 71.25,67.65 71.25,66.75 71.5,66.5 71.5,65.1 72.5,64.1 81.9,64.1 82.9,63.1 82.9,57.4 82.75,57.25 U9.39
!FPGA_PROG
  Top 0.2: U8.2 U8.1 80.75,63.15 80.2,63.7 72.3,63.7 70.95,65.05 R44.2 70.95,66.45 69.9,67.5 69.6,67.5 69.35,67.75 U5.36
!LED3
  Top 0.2: U5.55 62.75,77.25 62.5,77.5 62.5,80.75 LED3.K
!MCU_RESET  (via drill 0.3)
  Top 0.2: SW2.B2 51.92,68.5 v52.8,68.5 | v57.5,68.5 58.5,69.5 v58.5,71.5 | R36.1 58.75,77.8 U5.63 v58.75,74.5
  Bottom 0.2: v52.8,68.5 v57.5,68.5 | v58.75,74.5 58.75,71.75 v58.5,71.5
!MOT1_2_DO  (via drill 0.3)
  Top 0.2: v14.1,56.4 14.1,54.4 18,50.5 19.2,50.5 19.5,50.2 19.5,49.6 21.5,47.6 21.5,42.5 22,42 42.1,42 42.7,41.4 45.25,41.4 45.55,41.1 46.9,41.1 47.4,41.6 53.7,41.6 55.5,43.4 61,43.4 61.35,43.75 U9.93
  Bottom 0.2: U27.7 13.88,56.62 v14.1,56.4
!MOT1_2_LATCH  (via drill 0.3)
  Top 0.2: v14.1,52.5 14.8,52.5 20.3,47 20.3,42.7 19.9,42.3 v19.9,40.8 41.5,40.8 42.1,40.2 44.65,40.2 44.95,39.9 47.5,39.9 48,40.4 54.9,40.4 57.1,42.6 61.4,42.6 61.55,42.75 U9.95
  Bottom 0.2: v19.9,40.8 20.1,40.6 20.1,37.5 19.88,37.27 U26.1 | U27.1 13.88,52.73 v14.1,52.5
!MOT1_FAULT
  Top 0.2: RA2.B1 60.85,37.25 61.85,38.25 U9.104
!MOT1_HU_5  (via drill 0.3)
  Top 0.2: CN9.2.2 10.99,10.41 9.5,11.9 9.5,13.7 10.4,14.6 10.4,15.8 14.35,19.75 v15.25,19.75 15.51,19.75 CN9.1.3
  Bottom 0.2: U26.5 18.07,34.67 15.25,31.85 R80.2 v15.25,19.75
!MOT1_HV_5  (via drill 0.3)
  Top 0.2: v11,15.5 14.5,19 v16,19 16.17,19 CN9.1.4
  Bottom 0.2: v11,15.5 8.87,13.37 CN9.2.3 | U26.6 18.02,34.02 16,32 R81.2 v16,19
!MOT1_HW_5  (via drill 0.3)
  Top 0.2: CN9.2.4 7.74,14.1 9.3,14.1 10,14.8 10,16 v14.5,20.5 14.84,20.5 CN9.1.2
  Bottom 0.2: U26.4 18.12,35.33 14.7,31.9 R82.2 14.7,20.7 v14.5,20.5
!MOT1_OTW
  Top 0.2: RA2.A1 60.9,36.7 61.95,37.75 U9.105
!MOT1_RESET_A
  Top 0.2: U9.101 62.15,39.75 60.7,38.3 RA2.D1
!MOT1_RESET_B
  Top 0.2: U9.99 61.15,40.75 60.65,40.25 RA3.B1
!MOT1_RESET_C
  Top 0.2: RA3.C1 60.55,40.75 61.05,41.25 U9.98
!MOT2_FAULT
  Top 0.2: U9.82 61.35,49.25 60.85,49.75 RA4.B1
!MOT2_HU_5
  Top 0.2: CN11.1.3 18.2,76.04 18.2,77.2 15.8,79.6 14.6,79.6 13.7,80.5 11.9,80.5 10.41,79.01 CN11.2.2
  Bottom 0.2: CN11.2.2 8.87,77.47 5,73.6 5,71.2 10.3,65.9 10.3,64.15 R85.2 10.95,62.45 15.1,58.3 15.1,57.35 17.77,54.67 U27.13
!MOT2_HV_5  (via drill 0.3)
  Top 0.2: CN11.1.4 17.8,75.03 17.8,76.7 v15.5,79
  Bottom 0.2: v15.5,79 13.37,81.13 CN11.2.3 10.99,78.99 5.4,73.4 5.4,71.4 10.95,65.85 R86.2 11.5,64.45 11.5,62.5 15.5,58.5 15.5,57.55 17.73,55.33 U27.12
!MOT2_HW_5
  Top 0.2: CN11.1.2 18.6,77.06 18.6,77.4 16,80 14.8,80 14.1,80.7 14.1,82.26 CN11.2.4
  Bottom 0.2: CN11.2.4 11.55,83.25 4.6,76.3 4.6,71 9.65,65.95 R87.2 9.65,63.15 14.7,58.1 14.7,57.15 17.82,54.02 U27.14
!MOT2_OTW
  Top 0.2: U9.83 61.25,48.75 60.8,49.2 RA4.A1
!MOT2_RESET_A
  Top 0.2: U9.80 61.55,50.25 61,50.8 RA4.D1
!MOT2_RESET_B
  Top 0.2: U9.78 62.35,51.25 60.85,52.75 RA5.B1
!MOT2_RESET_C
  Top 0.2: U9.75 62.25,52.75 61.75,53.25 RA5.C1
!MOT3_4_5_DO  (via drill 0.3)
  Top 0.2: v135.9,34 135.9,35.6 132,39.5 130.8,39.5 130.5,39.8 130.5,40.4 128.5,42.4 128.5,47.5 128,48 107.9,48 107.3,48.6 104.75,48.6 104.45,48.9 103.1,48.9 102.6,48.4 96.3,48.4 94.15,46.25 U9.21
  Bottom 0.2: U31.7 136.22,33.38 135.9,33.7 v135.9,34
!MOT3_4_5_LATCH  (via drill 0.3)
  Top 0.2: v135.9,37.5 135.2,37.5 129.7,43 129.7,47.3 130.1,47.7 v130.1,49.2 108.5,49.2 107.9,49.8 105.35,49.8 105.05,50.1 102.5,50.1 102,49.6 95.1,49.6 92.75,47.25 U9.23
  Bottom 0.2: v130.1,49.2 129.9,49.4 129.9,52.5 130.12,52.73 U30.1 | U31.1 136.12,37.27 v135.9,37.5
!MOT3_FAULT
  Top 0.2: RA6.B1 89.35,52.75 88.85,52.25 U9.33
!MOT3_HU_5  (via drill 0.3)
  Top 0.2: CN13.2.2 139.01,79.59 140.5,78.1 140.5,76.3 139.6,75.4 139.6,74.2 135.65,70.25 v134.75,70.25 134.49,70.25 CN13.1.3
  Bottom 0.2: U30.5 131.93,55.33 134.75,58.15 R90.2 v134.75,70.25
!MOT3_HV_5  (via drill 0.3)
  Top 0.2: v139,74.5 135.5,71 v134,71 133.83,71 CN13.1.4
  Bottom 0.2: v139,74.5 141.13,76.63 CN13.2.3 | U30.6 131.97,55.98 134,58 R91.2 v134,71
!MOT3_HW_5  (via drill 0.3)
  Top 0.2: CN13.2.4 142.26,75.9 140.7,75.9 140,75.2 140,74 v135.5,69.5 135.16,69.5 CN13.1.2
  Bottom 0.2: v135.5,69.5 135.3,69.3 R92.2 135.3,58.1 131.88,54.67 U30.4
!MOT3_OTW
  Top 0.2: U9.34 88.75,52.75 89.3,53.3 RA6.A1
!MOT3_RESET_A
  Top 0.2: U9.30 88.55,50.75 89.5,51.7 RA6.D1
!MOT3_RESET_B
  Top 0.2: RA7.B1 89.15,49.75 88.55,49.15 87.25,49.15 87.15,49.25 U9.27
!MOT3_RESET_C
  Top 0.2: U9.26 88.75,48.75 89.25,49.25 RA7.C1
!MOT4_FAULT
  Top 0.2: U9.10 88.15,40.75 88.65,40.25 RA8.B1
!MOT4_HU_5
  Top 0.2: CN15.1.3 131.8,13.96 131.8,12.8 134.2,10.4 135.4,10.4 136.3,9.5 138.1,9.5 139.59,10.99 CN15.2.2
  Bottom 0.2: U31.12 131.93,34.67 139.05,27.55 R95.2 139.7,25.85 139.7,24.1 145,18.8 145,16.4 141.13,12.53 CN15.2.2
!MOT4_HV_5  (via drill 0.3)
  Top 0.2: CN15.1.4 132.2,14.97 132.2,13.3 v134.5,11
  Bottom 0.2: U31.11 131.97,34.02 138.5,27.5 138.5,25.55 R96.2 139.05,24.15 144.6,18.6 144.6,16.6 139.01,11.01 CN15.2.3 136.63,8.87 v134.5,11
!MOT4_HW_5
  Top 0.2: CN15.1.2 131.4,12.94 131.4,12.6 134,10 135.2,10 135.9,9.3 135.9,7.74 CN15.2.4
  Bottom 0.2: U31.13 131.88,35.33 140.35,26.85 R97.2 140.35,24.05 145.4,19 145.4,13.7 138.45,6.75 CN15.2.4
!MOT4_OTW
  Top 0.2: U9.11 88.25,41.25 88.7,40.8 RA8.A1
!MOT4_RESET_A
  Top 0.2: U9.8 87.95,39.75 88.5,39.2 RA8.D1
!MOT4_RESET_B
  Top 0.2: U9.6 87.75,38.75 89.25,37.25 RA9.B1
!MOT4_RESET_C
  Top 0.2: U9.5 87.65,38.25 89.15,36.75 RA9.C1
!MOT5_FAULT
  Top 0.2: RA10.B1 83.65,30.75 82.25,32.15 U9.141
!MOT5_HU_5  (via drill 0.3)
  Top 0.2: v142.6,30 142.8,29.8 142.8,21.4 145.8,18.4 145.8,12.6 137.4,4.2 136.1,4.2 135,5.3 121.51,5.3 CN17.6
  Bottom 0.2: v142.6,30 141.9,30.7 139.3,30.7 138.9,31.1 138.9,33.9 138.12,34.67 U31.5 | R119.1 119,6.19 CN17.6
!MOT5_HV_5  (via drill 0.3)
  Top 0.2: v141.8,30 142.4,29.4 142.4,21.2 145.4,18.2 145.4,12.8 137.2,4.6 136.3,4.6 135.2,5.7 123.65,5.7 CN17.7
  Bottom 0.2: v141.8,30 141.5,30.3 139.1,30.3 138.5,30.9 138.5,33.5 137.97,34.02 U31.6 | R120.1 121.5,6.15 CN17.7
!MOT5_HW_5  (via drill 0.3)
  Top 0.2: v134.1,35.5 134.5,35.1 134.5,33.9 138,30.4 140.6,30.4 142,29 142,21 145,18 145,13 137,5 136.5,5 135.4,6.1 125.79,6.1 CN17.8
  Bottom 0.2: U31.14 133.62,35.98 v134.1,35.5 | R121.1 124,6.11 CN17.8
!MOT5_OTW
  Top 0.2: U9.142 82.75,32.25 83.7,31.3 RA10.A1
!MOT5_RESET_A
  Top 0.2: RA10.D1 83.5,29.7 81.25,31.95 U9.139
!MOT5_RESET_B
  Top 0.2: U9.137 80.25,31.15 83.65,27.75 RA11.B1
!MOT5_RESET_C
  Top 0.2: U9.134 78.75,32.05 83.55,27.25 RA11.C1
!SETTING_BOOTLOADER
  Top 0.2: J1.2 52.5,72 55.25,69.25 U5.10
!SETTING_CHARGER
  Top 0.2: U5.7 54.65,70.75 52.4,73 50,73 J1.4
!SETTING_ID0
  Top 0.2: U5.11 55.15,68.75 52.9,71 48,71 J1.6
!SETTING_ID1
  Top 0.2: U5.12 55.05,68.25 52.7,70.6 46.4,70.6 J1.8
!SETTING_ID2
  Top 0.2: J1.10 44.8,70.2 52.5,70.2 54.95,67.75 U5.13
!SW1
  Top 0.2: U5.16 55,66.25 54.5,65.75 54.5,64.5 53.85,63.85 SW3.B2
!XBEE_CTS
  Top 0.2: CN7.12 53,20 53,22 56,25 58.4,25 62.8,29.4 66.3,29.4 69.25,32.35 U9.115
!XBEE_RST  (via drill 0.3)
  Top 0.2: U9.123 73.25,26.95 75,25.2 75,20 | 75,20 74,19 v72.4,19 | R53.2 75.55,20 75,20
  Bottom 0.2: CN7.5 72,11 72,18.6 v72.4,19
+1V2  (via drill 0.6, 0.8)
  Top 1: v94,66 93,66 86.25,59.25 v86.25,56.25
  Bottom 0.2: 90.5,69.5 90.25,69.75 85.55,69.75 85.35,69.95 85.35,74.45 87.35,76.45 87.35,80.45 90.3,83.4 92.2,83.4 93.05,84.25 R14.2
  Bottom 0.25: C56.2 74.25,45.75 C63.1 75.75,42.05 C55.2 | C58.2 76.25,49.75 78,48 | C62.2 78,45.25 | C60.2 82.25,49.75 81,51
  Bottom 1: v86.25,56.25 81,51 78,48 78,45.25 78,44.3 C63.1
  pour Bottom (isolate 0.125, no thermals): 90.2,69.8 94.8,69.8 94.8,65.2 90.2,65.2
+1V8  (via drill 0.3)
  Top 0.25: U5.22 v60.75,62.7 60.1,62.7 59.75,63.05 U5.20 59.75,65.1 59.9,65.25 v59.9,66 | U5.8 v57.35,70.25 | U5.56 v62.25,74.65 | U5.53 v63.75,74.75
  Bottom 0.25: C27.1 v57.35,70.25 59.33,70.25 59.38,70.2 | C32.1 v62.25,74.65 62.25,74 | 62.25,74 63.2,74 63.75,74.55 v63.75,74.75 63.75,75 | C34.1 63.75,75 | C25.1 63.75,75 | 62.25,74 59.38,71.12 59.38,70.2 | v59.9,66 59.38,66.53 C31.1 59.38,70.2 | C29.1 61,62.7 v60.75,62.7
+3V3  (via drill 0.3, 0.8)
  Top 0.2: v17.6,39.2 v15.5,39.2 | v18.9,49.9 19.1,49.7 19.1,49.4 21.1,47.4 v21.1,42 21.5,41.6 41.9,41.6 42.5,41 45.05,41 45.35,40.7 47.1,40.7 47.6,41.2 54.2,41.2 v55.5,42.5 | v132.4,50.8 v134.5,50.8 | v131.1,40.1 130.9,40.3 130.9,40.6 128.9,42.6 v128.9,48 128.5,48.4 108.1,48.4 107.5,49 104.95,49 104.65,49.3 102.9,49.3 102.4,48.8 95.8,48.8 v94,47 | R58.2 R59.2 57.88,5 C67.1 60,5.12 RF2.2 | v49.5,11 55.19,11 | U13.6 57.73,11 | 57.73,11 v60.5,11 | U13.5 55.19,11 | 55.19,11 57.73,11 | C162.1 32.1,22.35 U38.5 34.65,22.35 35.1,21.9 45.5,21.9 53.6,30 v60.3,30 | U29.21 48.25,44.75 48.55,45.05 C139.1 53.05,45.05 v55,47 | v58,45 58.05,45.05 R103.2 62.7,45.05 62.9,45.25 U9.90 | U9.86 58.25,47.25 v58,47 | U33.21 101.75,45.25 101.45,44.95 C147.1 v96.5,44.95 | U9.18 87.1,44.75 87.2,44.65 87.8,44.65 88.7,45.55 R109.2 v92.6,45.55 | C165.1 117.9,23.65 U41.5 115.35,23.65 114.9,24.1 v106,24.1 105.5,24.1 104.2,25.4 104.2,26.6 98.4,32.4 92,32.4 v88.4,36 | C148.1 106.58,10.53 U36.4 108.33,10.53 108.6,10.8 | R115.2 R116.2 109.95,9.45 108.6,10.8 | 108.6,10.8 108.6,18.3 v106,20.9 | 84.95,69.45 85,69.5 | C164.1 120.9,67.65 U40.5 118.35,67.65 117.9,68.1 116.1,68.1 114.3,66.3 v113.5,66.3 | v105.8,63.5 105.6,63.3 101.7,63.3 94.4,56 90,56 87.75,53.75 v87.5,53.75 | U5.18 U5.19 | v65.75,62.75 65.75,62.15 66.8,61.1 68.4,61.1 68.65,60.85 U10.5 68.65,59.4 C38.1 | U8.5 85,63.15 | RA1.B1 57.75,83 | RA1.D1 58.8,83 | 58.8,83 57.75,83 | 57.75,83 56.85,83 56.5,82.65 56.5,75.5 56.65,75.35 | 58.8,83 59.15,83 59.35,83.2 59.35,84.5 | 59.35,84.5 59.35,85.92 CN5.3 | U1.4 93.62,83.45 C1.1 85.45,83.45 82.2,80.2 82.2,76.2 v82,76 | C163.1 29.6,67.65 U39.4 31.35,67.65 32,67 32,66.4 32.5,65.9 44.6,65.9 45.1,65.4 48.6,65.4 51,63 55,63 57.5,65.5 v59.25,65.5
  Top 0.2: v65.35,61.05 65.55,60.85 R3.2 R2.2 65.55,58.05 66.25,57.35 U9.72 | R42.2 59.35,84.5 | C64.1 75.45,9.5 v75.05,9.1 74.95,9 64.5,9 | X1.4 79.22,73.33 C23.1 83.05,73.05 v84,74 | U7.8 85,68.91 85,68.9 | C37.1 82.5,69.06 U7.8 | U7.3 76.44,66.36 v76.6,66.2 | v78.8,66.2 78.8,67 80.7,68.91 U7.8
  Top 0.25: FB1.1 67.5,2 64.5,5 | 64.5,5 64.5,9 v64.5,11 v64.5,18.5 64.5,20.9 | 64.5,20.9 64.5,22 64,22.5 64,24.5 | RF2.2 61.88,4 63.5,4 64.5,5 | U9.31 v84.75,51.25 82.75,51.25 82,52 | v87.5,53.75 U9.36 85,53.75 84.38,54.38 | U9.63 v70.75,54.75 71,54.5 71,50.5 | U9.76 65.1,52.25 v65.25,52.4 67.6,52.4 70.25,49.75 | U9.90 65.75,45.25 v66,45 69.5,45 | U9.53 75.75,54.25 v75.5,54 75.5,50.5 | U9.86 v65.25,47.25 69.5,47.25 | U9.122 v72.75,35.25 70.5,37.5 v70.5,39.5 | U9.129 76.25,35.5 v76.75,36 76.75,39.5 | U9.135 79.25,35.1 v79.1,35.25 79,35.35 79,39.5 | U9.20 85.25,45.75 v84.75,46.25 80.5,46.25 | U9.103 v65.25,38.75 67,40.5 v69.5,40.5 | 74,39.5 v74,35.25 74.25,35 U9.125 | U9.4 84.9,37.75 v84.75,37.9 81.65,41 80.5,41 | 80.5,44.25 v84.75,44.25 85.25,44.75 U9.18 | 83.12,53.12 82.88,53.12 v81.25,54.75 U9.42 81.25,57.29 CN18.2 | v64,28 64,24.5 | U5.21 60.25,64.95 60.55,65.25 v60.55,65.35 60.55,70.55 61,71 v62.75,69.25 | U5.19 v59.25,65.5 | U5.48 v68,74.5 67.33,75.17 67.17,75.17 | v65.75,62.75 U5.32 65.75,66.25 v65.25,66.75 | R36.2 58.25,77.2 U5.64 v57.6,76 57.5,76 56.75,75.25 | U13.1 64.5,20.9 | v45.25,83.35 45,83.6 34.8,83.6 32.3,86.1 32.3,87.2 33.1,88 34.82,88 CN2.2 | CN6.1 64,24.5
  Top 0.5: v69.5,39.5 64,34 v64,33 | v82,76 68,76 67.17,75.17 65,73 63,73 61,71 56.75,75.25 56.65,75.35 54,78 v50.5,78 | v84,74 86.5,71.5 v86.5,71
  Top 1: v86.5,71 85,69.5 85,68.9 85,63.15 85,55 84.38,54.38 83.12,53.12 82,52 80.5,50.5 | 80.5,50.5 80.5,46.25 80.5,44.25 80.5,41 79,39.5 76.75,39.5 74,39.5 v70.5,39.5 v69.5,39.5 v69.5,40.5 69.5,45 69.5,47.25 69.5,49 70.25,49.75 71,50.5 75.5,50.5 80.5,50.5
  Bottom 0.2: R20.2 90.5,83 87.75,80.25 87.75,76.25 85.75,74.25 85.75,72 | U27.16 18.55,52.73 C133.1 18.55,50.25 v18.9,49.9 | U26.16 13.45,37.27 C132.1 14.15,39.2 v15.5,39.2 | v21.1,42 20.2,42 17.6,39.4 v17.6,39.2 | U31.16 131.45,37.27 C141.1 131.45,39.75 v131.1,40.1 | U30.16 136.55,52.73 C140.1 135.85,50.8 v134.5,50.8 | v128.9,48 129.8,48 132.4,50.6 v132.4,50.8 | R54.2 R55.2 v49.5,11 | v60.5,11 v64.5,11 | v55.5,42.5 v58,45 | v58,47 v55,47 | v94,47 92.55,45.55 | v92.6,45.55 92.55,45.55 | v96.5,44.95 93.15,44.95 92.55,45.55 | v60.3,30 61,30 v64,33 | v106,20.9 v106,24.1 | v88.4,36 86.5,37.9 v84.75,37.9 | v105.8,63.5 110.7,63.5 v113.5,66.3 | 57.55,75.95 v57.6,76 | v65.35,61.05 65.75,61.45 v65.75,62.75 | R37.2 45.4,83.5 v45.25,83.35 | U11.14 v75.05,9.1 | U11.1 v75.05,9.1 | U11.9 78.3,8.8 78,9.1 v75.05,9.1 | v76.6,66.2 v78.8,66.2
  Bottom 0.25: C48.1 75.45,53.95 v75.5,54 | C47.1 65.4,52.55 v65.25,52.4 | C49.1 65.3,47.2 v65.25,47.25 | C50.1 66.05,44.95 v66,45 | C41.1 v72.75,35.25 C39.1 | C43.1 v74,35.25 C40.1 | C52.1 76.8,36.05 v76.75,36 | C45.1 79.1,35.9 v79.1,35.25 | C59.1 84.45,44.25 v84.75,44.25 | C44.1 84.45,46.25 v84.75,46.25 | C61.1 84.45,50.95 v84.75,51.25 | C54.1 70.8,54.8 v70.75,54.75 | C53.1 81.05,54.95 v81.25,54.75 | v65.25,38.75 65.55,38.75 C51.1 | C57.1 84.6,38.05 v84.75,37.9 | C46.1 87.45,53.8 v87.5,53.75 | v60.55,65.35 60.5,65.3 C26.1 C35.1 v59.25,65.5 | C30.1 67.55,74.95 v68,74.5 | C28.1 65.55,62.95 v65.75,62.75 | C33.1 57.55,75.95 | v62.75,69.25 v65.25,66.75 | v45.25,83.35 45.25,80.03 CN4.4
  Bottom 0.5: v64,28 v64,33 | v82,76 v84,74 | CN4.4 48.08,77.2 49.7,77.2 v50.5,78
  pour Bottom (isolate 0.125, no thermals): 92.3,73.3 92.3,70.2 85.7,70.2 85.7,72.3 90.2,72.3 90.2,73.3
  pour Bottom (isolate 0.2, no thermals): 70.25,42.25 69.25,41.25 69.25,39.25 71.25,39.25 72.25,40.25
+5V  (via drill 0.3)
  Top 0.2: R107.1 100.6,40.15 R106.2 99.75,39.5 v99.75,39.25 99.95,39.05 R113.2 101.1,39.15 U35.4 | R101.1 49.4,49.85 R100.2 50.25,50.5 v50.25,50.75 50.05,50.95 R111.2 48.9,50.85 U34.4 | RF1.2 62.62,8.38 61.5,9.5 v61.5,26
  Bottom 0.2: v61.5,26 61.5,27
  pour Bottom (isolate 0.25, no thermals): 100.5,60.5 100.5,56.5 99.5,56.5 99.5,27.5 50.5,27.5 50.5,51 50,51 50,27 100,27 100,56 102.25,56 102.25,60.5
+5V/2  (via drill 0.3)
  Top 0.2: CN9.2.8 8.87,15.47 13.5,20.1 13.5,20.57 CN9.1.1 15.16,22.44 C128.1 14,26.5 14,32.75 CN10.4 | CN11.2.8 15.47,81.13 20.6,76 21.07,76 CN11.1.1 23.5,73.57 23.5,73 C129.1 | CN12.4 12.25,60.75 17,56 17,52.1 18.2,50.9 19.4,50.9 20.1,50.2 v20.1,49.9 22,48 RF3.1
  Bottom 0.2: CN11.2.8 15.23,82.67 13.5,84.4 12.1,84.4 4.2,76.5 4.2,70.8 9.1,65.9 9.1,61.65 CN12.4 | v20.1,49.9 20.3,49.7 20.3,43.3 16.8,39.8 13.05,39.8 CN10.4
+5V/3  (via drill 0.3)
  Top 0.2: CN14.4 136,57.25 136,63.5 C130.1 134.84,67.56 CN13.1.1 136.5,69.43 136.5,69.9 141.13,74.53 CN13.2.8 | RF4.1 128,42 v129.9,40.1 129.9,39.8 130.6,39.1 131.8,39.1 133,37.9 133,34 137.75,29.25 CN16.4 | v129,7.5 130.37,8.87 134.53,8.87 | C131.1 126.5,17 126.5,16.43 CN15.1.1 128.93,14 129.4,14 134.53,8.87 | CN15.2.8 134.53,8.87
  Bottom 0.2: CN16.4 140.9,28.35 140.9,24.1 145.8,19.2 145.8,13.5 137.9,5.6 136.5,5.6 134.77,7.33 CN15.2.8 | v129.9,40.1 129.7,40.3 129.7,46.7 133.2,50.2 136.95,50.2 CN14.4 | CN17.4 114.73,5.77 116.55,3.95 R119.2 R120.2 R121.2 125.45,3.95 v129,7.5
+12V  (via drill 0.3, 0.8)
  Top 0.2: v109.9,79.1 111.8,79.1 113.5,77.4 113.5,74.7 v113.3,74.5 | C83.P 40.25,71 R6.2
  Top 0.35: U17.17 U17.18 42.25,63.02 C84.1 v38.5,64.5 C88.1 27.75,63.02 U17.19 | U14.17 U14.18 42.25,38.02 C69.1 v38.5,39.5 C73.1 27.75,38.02 U14.19 | U20.17 U20.18 107.75,51.98 C99.1 v111.5,50.5 C103.1 122.25,51.98 U20.19 | U37.17 U37.18 89.47,22.25 C150.1 v88,17.5 C154.1 89.47,7.75 U37.19 | U17.36 27.75,51.98 C85.1 v38.5,50.5 C86.1 42.25,51.98 U17.1 | U14.36 27.75,26.98 C70.1 v38.5,25.5 C71.1 42.25,26.98 U14.1 | U37.1 100.53,22.25 C152.1 v102,17.5 C151.1 100.53,8 U37.36 | U23.17 U23.18 107.75,26.98 C114.1 v111.5,25.5 C118.1 122.25,26.98 U23.19 | U23.36 122.25,38.02 C115.1 v111.5,39.5 C116.1 107.75,38.02 U23.1 | U20.36 122.25,63.02 C100.1 111.5,64.5 | U20.1 107.75,63.02 C101.1 111.5,64.5 | 111.5,64.5 111.5,66.1
  Top 1: v104,65 105.1,66.1 111.5,66.1
  Bottom 0.2: R16.2 108.2,81 109.9,79.3 v109.9,79.1 | v113.3,74.5 112.5,74.5
  pour Bottom (isolate 0.125, no thermals): 108.2,74.3 110.7,74.3 110.7,74.8 112.8,74.8 112.8,69.2 109.2,69.2 109.2,70.2 108.2,70.2
  pour Top (isolate 0.2, no thermals): 111,50 111,72 112.5,72 112.5,70.5 112,70 112,50
  pour Bottom (isolate 0.2, no thermals): 37.5,72 37.5,70.5 38,70 38,64 39,64 39,72
  pour Bottom (isolate 0.2, no thermals): 38,51 38,39 39,39 39,51
  pour Bottom (isolate 0.2, no thermals): 38,26 38,18 46.5,18 49.5,21 74.5,21 78.5,17 81.25,17 81.25,16.5 82.75,16.5 82.75,17 88.5,17 88.5,18 79,18 75,22 49,22 46,19 39,19 39,26
  pour Bottom (isolate 0.2, no thermals): 101.5,18 101.5,17 110,17 112,19 112,26 111,26 111,19.5 109.5,18
  pour Bottom (isolate 0.2, no thermals): 111,39 111,51 112,51 112,39
  pour Top (isolate 0.2, no thermals): 38,65 38,50 39,50 39,65
  pour Top (isolate 0.2, no thermals): 38,25 38,40 39,40 39,25
  pour Top (isolate 0.2, no thermals): 102.5,18 102.5,17 87.5,17 87.5,18
  pour Top (isolate 0.2, no thermals): 111,40 111,25 112,25 112,40
ADC1_MISO
  Top 0.2: R102.2 53.2,43.5 57.45,47.75 U9.85
ADC1_MOSI
  Top 0.2: U29.18 53.1,42.8 56.7,46.4 58.8,46.4 59.15,46.75 U9.87
ADC1_SCLK
  Top 0.2: U29.17 45.75,42.1 45.95,41.9 46.5,41.9 47,42.4 53.3,42.4 56.9,46 59,46 59.35,46.35 62.8,46.35 62.9,46.25 U9.88
ADC2_MISO
  Top 0.2: U9.14 93.05,42.75 96.8,46.5 R108.2
ADC2_MOSI
  Top 0.2: U33.18 96.9,47.2 92.95,43.25 U9.15
ADC2_SCLK
  Top 0.2: U33.17 104.25,47.9 104.05,48.1 103.5,48.1 103,47.6 96.7,47.6 92.85,43.75 U9.16
BALL_DETECT/BALL_SDA  (via drill 0.3)
  Top 0.2: v46,16 47.1,17.1 47.1,20.2 52.7,25.8 58,25.8 62.4,30.2 65.9,30.2 67.75,32.05 U9.112
  Bottom 0.2: R56.2 v46,16
BALL_EN  (via drill 0.3)
  Top 0.2: U12.5 56.5,8 56.05,8.45 R60.2 v57,10 | v57,16 57,17.5 56.5,18 56.5,22.5 63,29 66.5,29 69.75,32.25 U9.116
  Bottom 0.2: v57,10 v57,16
BALL_SCL  (via drill 0.3)
  Top 0.2: v47.5,16 47.5,20 52.9,25.4 58.2,25.4 62.6,29.8 66.1,29.8 68.75,32.45 U9.114
  Bottom 0.2: R57.2 v47.5,16
BUZZER_PWM  (via drill 0.3)
  Top 0.2: U13.3 57.73,19.27 v60,17
  Bottom 0.2: R45.1 60.7,16.3 v60,17 C65.1
CHARGER_RX
  Top 0.2: CN2.5 36.18,84 49.8,84 52.6,81.2 53.8,81.2 55.5,79.5 R39.2
CHARGER_TX
  Top 0.2: CN2.6 38.78,84.4 50,84.4 52.8,81.6 54,81.6 54.6,81 R38.2
DEBUG_RX
  Top 0.2: RA1.C2 58.25,84.15 56.73,85.67 CN5.2
DEBUG_TX
  Top 0.2: RA1.A2 56.59,83.6 CN5.1
EXT1_CE
  Top 0.2: U9.117 70.25,26.1 CN6.2
EXT1_CSN
  Top 0.2: U9.119 71.25,24.56 CN6.3
EXT1_IRQ
  Top 0.2: U9.132 77.75,28.1 CN6.7
EXT1_MISO
  Top 0.2: U9.127 75.25,32.85 75.1,32.7 75.1,28.21 CN6.6
EXT1_MOSI
  Top 0.2: U9.124 73.75,27.02 CN6.5
EXT1_SCK
  Top 0.2: U9.121 72.25,25.98 CN6.4
FPGA_AUX0  (via drill 0.3)
  Top 0.2: U5.30 64.75,60.75 65,60.5 65,55.6 65.6,55 67.5,55 67.75,55.25 U9.69 67.75,57.75 v67.9,57.9
  Bottom 0.2: CN18.8 69.73,59.73 v67.9,57.9
FPGA_AUX1  (via drill 0.3)
  Top 0.2: U5.26 62.75,56.65 65.2,54.2 69.2,54.2 70.25,55.25 U9.64 70.25,57.45 70.6,57.8 v73.4,57.8
  Bottom 0.2: v73.4,57.8 74.34,57.8 CN18.4
FPGA_AUX2  (via drill 0.3)
  Top 0.2: U5.40 70.45,69.75 70.7,69.5 76.3,69.5 77.2,68.6 77.2,65.9 v76.7,65.4 | CN18.3 77.5,61.04 77.5,59.2 78.25,58.45 U9.48
  Bottom 0.2: CN18.3 76.27,64.97 v76.7,65.4
FPGA_CLK  (via drill 0.3)
  Top 0.2: v78,64.7 78,68 79.05,69.05 R32.2 | U9.50 v77.25,58.5
  Bottom 0.2: v78,64.7 78,64 77.5,63.5 77.5,58.75 v77.25,58.5
FPGA_CONF
  Top 0.2: U5.33 68,64.6 68.65,63.95 U10.1
FPGA_DONE
  Top 0.2: U9.71 66.75,57.45 66.5,57.7 66.5,60.8 65.15,62.15 65.15,63.05 65.25,63.15 U5.31
FPGA_TCK
  Top 0.2: U9.109 66.25,32.75 65.9,32.4 63.6,32.4 63.3,32.7 63.3,34.2 P1.1
FPGA_TDI
  Top 0.2: U9.110 66.75,32.65 66.1,32 63.4,32 62.5,32.9 P2.1
FPGA_TDO
  Top 0.2: P3.1 60.4,35 62.65,37.25 U9.106
FPGA_TMS
  Top 0.2: U9.107 62.75,36.75 59.5,33.5 P4.1
GND  (via drill 0.3, 0.8, 1, 2.1)
  Top 0.5: v61,97 61,94.7 CN3.S1 | v69,97 69,94.7 CN3.S2
  Bottom 0.2: U3.2 98.5,61
  other vias: 95.25,76 103.75,76 99.15,81.1 92.55,78 89.5,68 89.5,66.5 89.5,65 109.5,68 109.5,67.2 116,72.5 116,74.5 110,78 111,78 100.7,85.25 107.75,81.75 91.5,81.5 90.4,77.25 89.25,73 86.5,73.75 89.75,75.5 88.25,75.5 114,79.5 113,81.25 98.75,83.5 113,67 113,68 87,66.5 87,65 87,68 43,47 43,43 25,44 125,46 115,78 102,65 94,64 84.5,71 65.25,42.25 84.85,37.05 84.75,42.25 84.75,48.25 77.75,54.75 75.15,54.75 68.65,57.6 65.15,51.55 65.25,44.65 65.25,37 68.25,35.25 76.9,35.25 79.95,35.15 87.75,73 58.25,62.75 55.5,74.5 66.5,76.5 61.5,65.35 107,43 107,47 36,63.5 36,59 36,62.5 36,60.5 36,57.5 36,55.5 36,54.5 36,52.5 36,51.5 37,63 37,58 37,60 37,55 37,52 40,56 36,38.5 36,37.5 37,38 36,35.5 36,34 36,32.5 37,35 37,33 36,30.5 36,29.5 37,30 36,27.5 36,26.5 37,27 40,60 40,35 40,31 114,63.5 114,62.5 113,63 114,60.5 114,59.5 113,60 114,57.5 114,54.5 114,56 113,57 113,55 114,52.5 113,52 114,51.5 110,55 110,59 114,38.5 113,38 114,37.5 114,35.5 113,35 114,34.5 114,32.5 113,32 114,31 113,30 114,29.5 114,27.5 114,26.5 113,27 110,30 110,34 89,14 90,14 89.5,16 92,14 95,14 93.5,14 92.5,16 94.5,16 97,14 98,14 97.5,16 100,14 101,14 100.5,16 26.5,24.5 43.5,24.5 26.5,38.5 43.5,38.5 96.5,20 92.5,20 43.5,51.5 26.5,51.5 28.5,49.5 26.5,65.5 43.5,63.5 105,64.5 123.5,65.5 123.5,51.5 106.5,51.5 106.5,38.5 121.5,40.5 106.5,26.5 123.5,26.5 103.5,9 87,6.5 101,23.5 89,23.5 15.75,37.75 17.75,52.75 132.25,57.75 134.25,52.25 137.75,31.75 132.25,37.25 17.75,32.75 17.75,24.25 16.5,18 17.75,73.75 133.25,71.7 132,16.5 132.25,65.75 102.7,85.25 34,69 28.5,65.5 27,84 25,88 27,90 27,88 125,88 123,90 123,88 133.5,3 121.5,23 79.5,32.4 46.5,57 46.5,32 103.5,33 103.5,58 93,28.2 74,65.5 67.25,63.75 82.25,62 75.3,57.6 75,71.5 81,71.55 64,90.25 70,92 68.5,92 61.5,92 53.5,91.25 125,77.5 137.5,65 25,77.5 13,65.5 12.5,25 25,12.5 125,12.5 137,24.5 55,19.5 59.5,24 60,3.5 86,3.5 79.5,29.5 71,45 74,45 75.5,43.5 75,41 79,44 78.5,42 77,41 79,47.5 79,46 76.5,48 76.5,45.5 71.5,47.5 74,48.5 77.5,49.5 66,49.5 63,55 80.5,60.7 54.5,60 87,55 93,55 98,43 52,47 65.5,69 53.5,28 42,20.5 45.5,20.5 61.5,32 56,32 89.5,31.5 93,34 101,26.5 104,19 106.5,19 110,21.5 78,15.5 69,28 75,4 98,52.5 98,50.5 101.5,52.5 101.5,50.5 98.5,55.5 103.5,55.5 52,39.5 48.5,39.5 48.5,37.5 52,37.5 51.5,34.5 48.5,34.5 72.5,38 75,38 81.5,40 80,38.5 79.5,52 82,47.5 68,44 69.5,38 78,38 103.5,39 113.5,21.5 81,77 76,77 89,85 52,80 98.75,45.75 71,79 44,14 71,81 44,16 52,58 91,58 65,83 67,87.45 68,21 92,26 81,68
  pour Bottom (isolate 0.125, no thermals): 93.7,76.3 94.65,76.3 95.05,76.8 99,76.8 99,78 100,78 100,76.6 95.8,76.7 95.8,76.15 95.35,75.7 93.7,75.7
  pour Bottom (isolate 0.125, no thermals): 105.3,76.3 105.3,75.7 103.55,75.7 103.2,76.05 103.2,76.7 99,76.7 99,78 100,78 100,76.8 103.95,76.8 104.45,76.3
  pour Bottom (isolate 0.125, rank 3, no thermals): 98,80.5 99.1,80.5 99.1,77 100,77 100,78 99.4,78 99.4,82 98,82
  pour Top (isolate 0.2, rank 6): -1,101 151,101 151,-1 -1,-1
  pour Bottom (isolate 0.2, rank 6): -2,102 152,102 152,-2 -2,-2
  pour Top (isolate 0.2, rank 5, no thermals): 20.5,65.5 20.5,49.5 45,49.5 45,65.5
  pour Top (isolate 0.2, rank 5, no thermals): 22.5,40.5 22.5,24.5 45,24.5 45,40.5
  pour Top (isolate 0.2, rank 5, no thermals): 105,65.5 105,49.5 127.5,49.5 127.5,65.5
  pour Top (isolate 0.2, rank 5, no thermals): 105,40.5 105,24.5 129.5,24.5 129.5,40.5
  pour Top (isolate 0.2, rank 5, no thermals): 87,5 104.5,5 104.5,25 87,25
  pour Top (isolate 0.2, rank 5, no thermals): 101.5,48.5 101.5,41.5 108.5,41.5 108.5,48.5
  pour Top (isolate 0.2, rank 5, no thermals): 41.5,48.5 41.5,41.5 48.5,41.5 48.5,48.5
  pour Top (isolate 0.2, rank 5, no thermals): 72.5,94 72.5,86 79.5,86 79.5,94
  pour Bottom (isolate 0.2, rank 5, no thermals): 72.5,94 72.5,86 79.5,86 79.5,94
  pour Top (isolate 0.2, rank 5, no thermals): 38,91 38,85.5 41,85.5 41,91
  pour Bottom (isolate 0.2, rank 5, no thermals): 38,91 38,85.5 41,85.5 41,91
IRDA_RX  (via drill 0.3)
  Top 0.2: U6.4 55.5,91 56.2,91.7 59.9,91.7 60.9,90.7 60.9,87.3 60.6,87 60.6,84 60.3,83.7 v60.3,81 | U5.59 60.75,78.95 v60.3,79.4
  Bottom 0.2: v60.3,81 v60.3,79.4
IRDA_SD
  Top 0.2: U6.5 54.55,90.65 56,92.1 60.1,92.1 61.3,90.9 61.3,88.3 63,86.6 63,77.6 63.25,77.35 U5.54
IRDA_TX  (via drill 0.3)